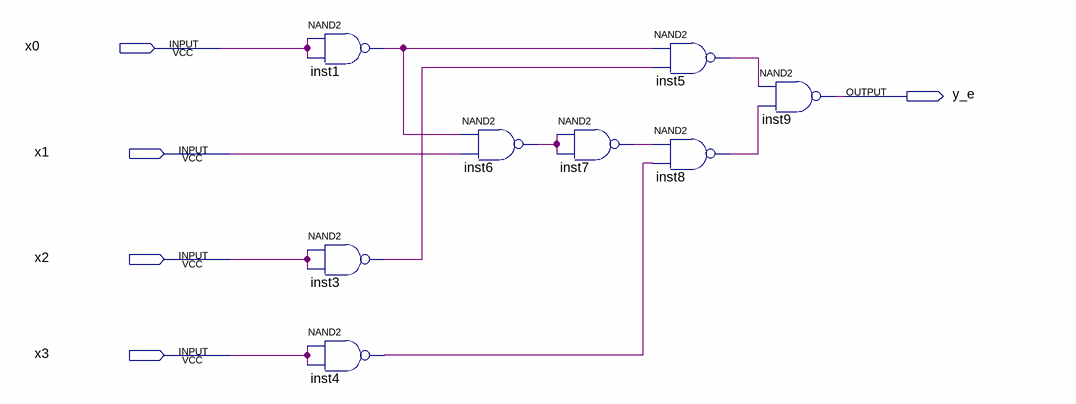
[diagram p0: schematic sheet]
// Quartus schematic y_e.bdf as structural Verilog: 8 symbols, 5 pins
module y_e (
  input  x0,
  input  x1,
  input  x2,
  input  x3,
  output y_e
);

  wire inst1_out, inst3_out, inst4_out, inst5_out, inst6_out, inst7_out, inst8_out;

  nand inst1 (inst1_out, x0, x0);
  nand inst3 (inst3_out, x2, x2);
  nand inst4 (inst4_out, x3, x3);
  nand inst6 (inst6_out, inst1_out, x1);
  nand inst7 (inst7_out, inst6_out, inst6_out);
  nand inst5 (inst5_out, inst1_out, inst3_out);
  nand inst8 (inst8_out, inst7_out, inst4_out);
  nand inst9 (y_e, inst5_out, inst8_out);
endmodule
